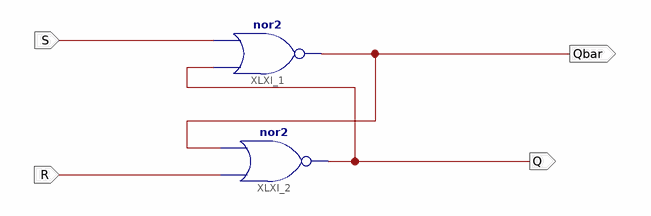
[diagram p0: schematic sheet 1]
// Xilinx ISE schematic SR_LATCH.sch (kintex7) as structural Verilog: 2 symbols, 4 ports
module SR_LATCH (
  input  S,
  input  R,
  output Qbar,
  output Q
);

  nor XLXI_1 (Qbar, Q, S);
  nor XLXI_2 (Q, R, Qbar);
endmodule
